# Altium project mini_project_one_rail.PrjPcb
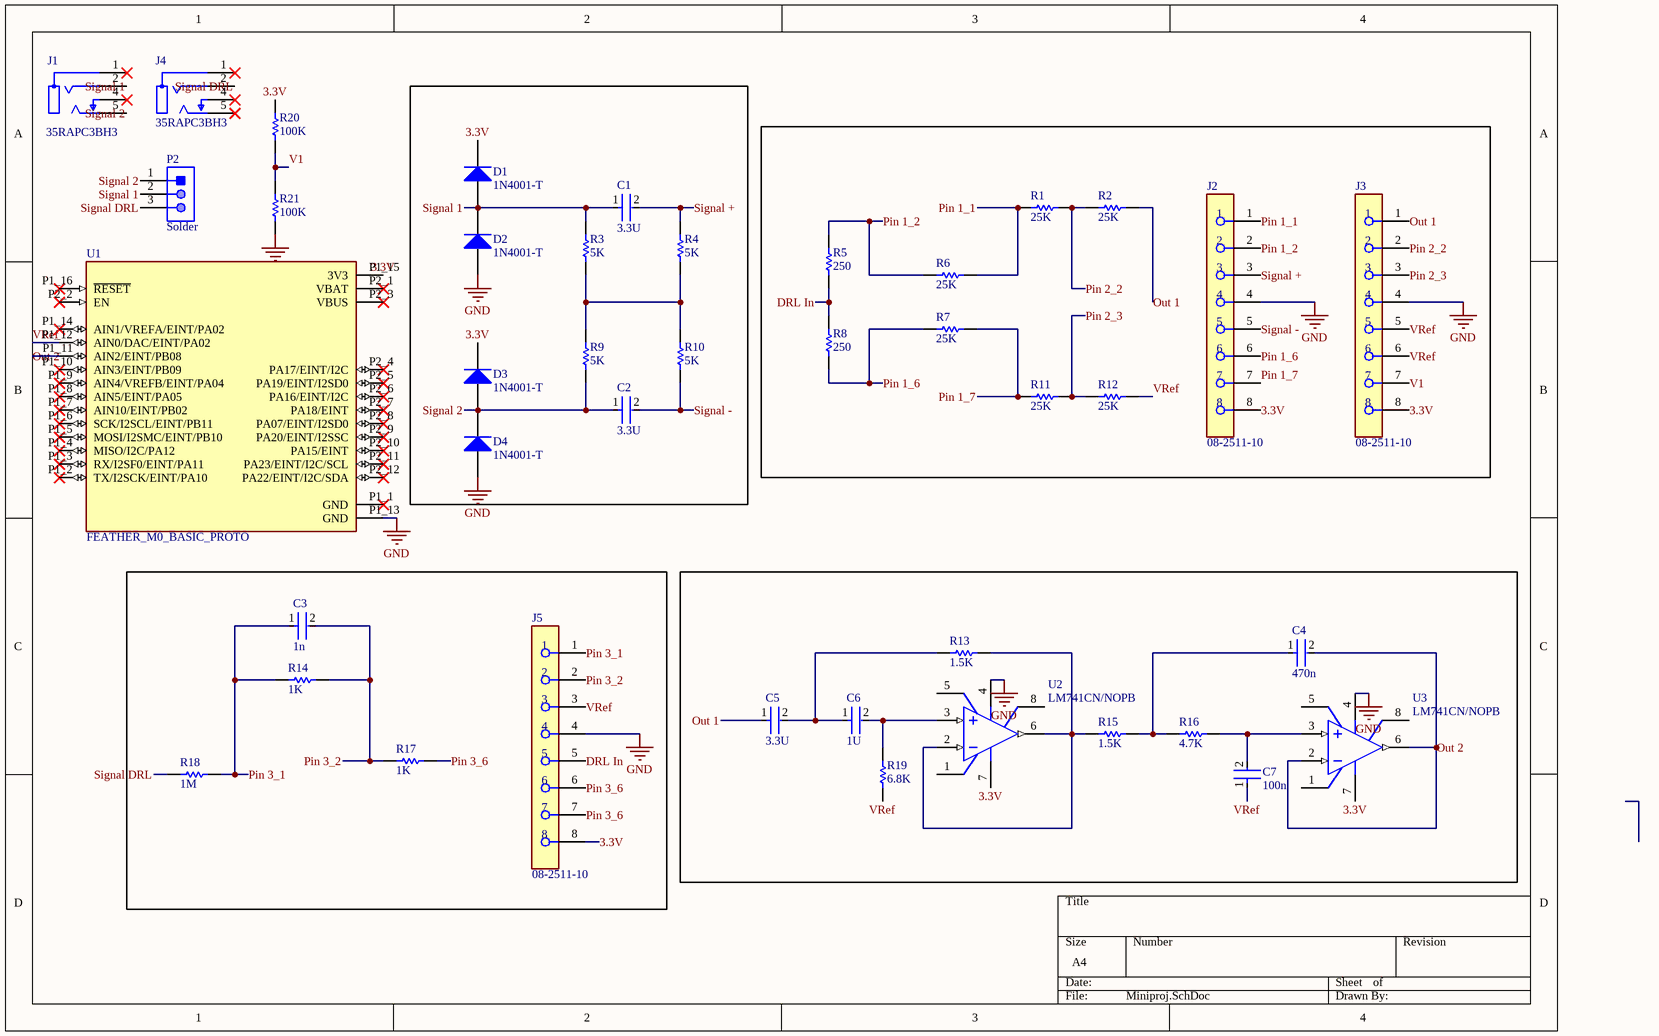
[diagram p0: Miniproj.SchDoc]
1 sheet, 41 parts. Net scope: global (net labels, ports and power ports of the same name join across sheets).
Board file: EMG.PcbDoc

## Sheet Miniproj.SchDoc
size A4; SheetNumber: 1; SheetTotal: 1

### Parts
C1  3.3U  [FP-RCE3DB-MFG]
C2  3.3U  [FP-RCE3DB-MFG]
C3  1n  [FP-RCE3DB-MFG]
C4  470n  [FP-RCE3DB-MFG]
C5  3.3U  [FP-RCE3DB-MFG]
C6  1U  [FP-RCE3DB-MFG]
C7  100n  [FP-RCE3DB-MFG]
D1  1N4001-T  [DIOD-DO-41-P-2_V]
D2  1N4001-T  [DIOD-DO-41-P-2_V]
D3  1N4001-T  [DIOD-DO-41-P-2_V]
D4  1N4001-T  [DIOD-DO-41-P-2_V]
J1  35RAPC3BH3  [FP-35RAPC3BH3-MFG]
J2  08-2511-10  [FP-08-2511-10-MFG]
J3  08-2511-10  [FP-08-2511-10-MFG]
J4  35RAPC3BH3  [FP-35RAPC3BH3-MFG]
J5  08-2511-10  [FP-08-2511-10-MFG]
P2  Solder  [JST-B3B-PH-K-S-3_V]
R1  25K  [RESA60-630X240]
R2  25K  [RESA60-630X240]
R3  5K  [RESA60-630X240]
R4  5K  [RESA60-630X240]
R5  250  [RESA60-630X240]
R6  25K  [RESA60-630X240]
R7  25K  [RESA60-630X240]
R8  250  [RESA60-630X240]
R9  5K  [RESA60-630X240]
R10  5K  [RESA60-630X240]
R11  25K  [RESA60-630X240]
R12  25K  [RESA60-630X240]
R13  1.5K  [RESA60-630X240]
R14  1K  [RESA60-630X240]
R15  1.5K  [RESA60-630X240]
R16  4.7K  [RESA60-630X240]
R17  1K  [RESA60-630X240]
R18  1M  [RESA60-630X240]
R19  6.8K  [RESA60-630X240]
R20  100K  [RESA60-630X240]
R21  100K  [RESA60-630X240]
U1  FEATHER_M0_BASIC_PROTO  [MODULE_FEATHER_M0_BASIC_PROTO]
U2  LM741CN/NOPB  [P0008A]
U3  LM741CN/NOPB  [P0008A]

### Nets
GND: D2.1(A) D4.1(A) J2.4 J3.4 J5.4 R21.1 U1.P1_13(GND) U2.4(V-) U3.4(V-)
3.3V: D1.2(K) D3.2(K) J2.8 J3.8 J5.8 R20.2 U1.P1_15(3V3) U2.7(V+) U3.7(V+)
DRL In: J5.5 R5.2 R8.1
Out 1: C5.1 J3.1 R2.1
Out 2: C4.2 U1.P1_11(AIN2/EINT/PB08) U3.2(IN-) U3.6(OUT)
Pin 1_1: J2.1 R1.2 R6.1
Pin 1_2: J2.2 R5.1 R6.2
Pin 1_6: J2.6 R7.2 R8.2
Pin 1_7: J2.7 R7.1 R11.2
Pin 2_2: J3.2 R1.1 R2.2
Pin 2_3: J3.3 R11.1 R12.2
Pin 3_1: C3.1 J5.1 R14.2 R18.1
Pin 3_2: C3.2 J5.2 R14.1 R17.2
Pin 3_6: J5.6 J5.7 R17.1
Signal 1: C1.1 D1.1(A) D2.2(K) J1.2 P2.2 R3.2
Signal 2: C2.1 D3.1(A) D4.2(K) J1.5 P2.1 R9.1
Signal +: C1.2 J2.3 R4.2
Signal -: C2.2 J2.5 R10.1
Signal DRL: J4.2 P2.3 R18.2
V1: J3.7 R20.1 R21.2
VRef: C7.1 J3.5 J3.6 J5.3 R12.1 R19.2 U1.P1_12(AIN0/DAC/EINT/PA02)
NetC4_1: C4.1 R15.1 R16.2
NetC5_2: C5.2 C6.1 R13.2
NetC6_2: C6.2 R19.1 U2.3(IN+)
NetC7_2: C7.2 R16.1 U3.3(IN+)
NetR3_1: R3.1 R4.1 R9.2 R10.2
NetR13_1: R13.1 R15.2 U2.2(IN-) U2.6(OUT)

Not connected (* = marked no-connect by the designer): J1 1* 4*; J4 1* 4* 5*; U1 P1_1(GND)* P1_2(TX/I2SCK/EINT/PA10)* P1_3(RX/I2SF0/EINT/PA11)* P1_4(MISO/I2C/PA12)* P1_5(MOSI/I2SMC/EINT/PB10)* P1_6(SCK/I2SCL/EINT/PB11)* P1_7(AIN10/EINT/PB02)* P1_8(AIN5/EINT/PA05)* P1_9(AIN4/VREFB/EINT/PA04)* P1_10(AIN3/EINT/PB09)* P1_14(AIN1/VREFA/EINT/PA02)* P1_16(~{RESET})* P2_1(VBAT)* P2_2(EN)* P2_3(VBUS)* P2_4(PA17/EINT/I2C)* P2_5(PA19/EINT/I2SD0)* P2_6(PA16/EINT/I2C)* P2_7(PA18/EINT)* P2_8(PA07/EINT/I2SD0)* P2_9(PA20/EINT/I2SSC)* P2_10(PA15/EINT)* P2_11(PA23/EINT/I2C/SCL)* P2_12(PA22/EINT/I2C/SDA)*; U2 1(OFS_NULL) 5(OFS_NULL) 8(NC); U3 1(OFS_NULL) 5(OFS_NULL) 8(NC)

### Library data of the parts
C1-C7 = CMP-06035-005830-1: Cap Ceramic 10uF 25V X7R ±10% Radial 2.5mm +125°C Automotive Ammo Pack; Lead/Base Style: Straight; Lead Diameter: 0.5mm; Case/Package: Radial; Voltage Rating (DC): 25V; Tolerance: 10%; Lead Pitch: 0.098inch; Termination: Radial; Height - Seated (Max): 0.197inch; Resistor Type: Ceramic; Min Operating Temperature: -55°C; Dielectric: X7R; Length: 0.217inch; Voltage Rating: 25V; Width: 0.157inch; Height: 5mm; Packaging: Tape and Reel; Ratings: AEC-Q200; Max Operating Temperature: 125°C; Package Quantity: 1500; Mount: Through Hole; Capacitance: 10uF
D1-D4 = CMP-0639-00006-2: 1.0 A Rectifier, 15 pF, 50 V, -65 to 150 degC, 2-Pin DO-41 Plastic, RoHS, Tape and Reel; Manufacturer: Diodes Inc; VF (V): 1; CT (pF): 15; Max. IR (uA): 5; VRRM (V): 50; Max. IFSM (A): 30; RoHS: TRUE; Mounting Technology: Through Hole; PartNumber: 1N4001-T; ComponentLink2Description: Datasheet; DatasheetVersion: Rev. 8-2; Operating Temperature Range (degC): -65 to 150; Packing: Tape and Reel; PackageReference: DO-41-P-2; ComponentLink1URL: http://diodes.com/; PackageDescription: 2-Pin Axial Lead, Body 4.635 x 2.36 mm, Lead Spread 25.4 mm; ComponentLink2URL: http://diodes.com/datasheets/ds28002.pdf; Max. Average Rectified Current IO (A): 1; ComponentLink1Description: Manufacturer URL
J1 J4 = CMP-47983-000003-1: CONN JACK STEREO 3.5MM R/A; Gender: Female; Number of Positions: 3; Body Color: Black; Number of Ports: 1; Voltage Rating: 500V; Shielding: Unshielded; Body Material: Brass; Orientation: Right Angle; RoHS Compliant: Yes; Termination: Solder; Lead Free: Lead Free; Package Quantity: 1; Series: 35; Housing Material: PBT; Color: Black; Packaging: Bulk; Contact Plating: Silver; Mount: Through Hole; Contact Material: Copper Alloy; Number of Terminals/Pins: 3
J2 J3 J5 = CMP-40957-000003-1: CONN IC DIP SOCKET 8POS TIN; Manufacturer: Aries Electronics; Pitch: 2.54mm; Conn Gender: Female; Is Female: yes; Number Of Contacts: 8; Current Rating: 1A; Standoff Height: 0.51mm; Conn Orientation: Vertical; Socket Package: DIP8; Device Class L2: IC and Component Sockets; Lead Free: Yes; Package: 0; Automotive: No; ComponentLink2URL: https://www.arieselec.com/products/data/12004-dip-test-socket.pdf; Contact Material: Tin; Height: 7.75mm; Digikey Description: CONN IC DIP SOCKET 8POS TIN; Temperature Range High: +105°C; RoHS: TRUE; ComponentLink2Description: Datasheet; Temperature: -55°C to +105°C; Temperature Range Low: -55°C; Device Class L1: Connectors; Device Class L3: unset; Manufacturer Part Number: 08-2511-10; Octopart: https://octopart.com/08-2511-10-aries-767661; Number Of Rows: 2; Category: Conn
P2 = CMP-2000-05164-1: Male Header, Pitch 2 mm, 1 x 3 Position, Height 6 mm, Tail Length 3.4 mm, -25 to 85 degC, RoHS, Bulk; Manufacturer: JST; Style/Orientation: StraightHeader/Plug; Pitch: 2mm; No of Positions: 3; Termination: Crimp; Manufacturer URL: http://www.jst.com/home2.html; Datasheet Version: Oct-06; Type: ShroudedHeader; Datasheet URL: https://datasheet.ciiva.com/11746/0900766b80826550-11746939.pdf
R1-R21 = CMP-1659-00075-1: Axial Resistor, 1 KOhm, +/- 1%, 250 mW, -55 to 155 degC, 2-Pin THD, RoHS, Bulk; Voltage Rating: 250 V; Resistance: 10 kohm; Power Rating: 250 mW; ComponentLink2Description: Datasheet; RoHSCompliant: true; PackageReference: MFR-25; Case\Package: Axial; Max Operating Temperature: 155 degC; DatasheetVersion: Apr-13; Tolerance: 1%; ComponentLink1URL: http://www.yageo.com/; Length: 0.248 inch; ComponentLink2URL: http://www.yageo.com/documents/recent/Yageo%20LR_MFR_2013.pdf; Packaging: Bulk; Package Quantity: 200; PackageDescription: 2-Pin Axial Lead, Dia 2.4 mm, Body Length 6.3 mm; Min Operating Temperature: -55 degC; ComponentLink1Description: Manufacturer URL
U1 = CMP-003-000000-1: ATSAMD21G18 Feather M0 Basic Proto series ARM® Cortex®-M0+ MCU 32-Bit Embedded Evaluation Board; MF: Adafruit Industries; Price: None; Source: FEATHER_M0_BASIC_PROTO.SchLib; Check_prices: https://www.snapeda.com/parts/Feather%20M0%20Basic%20Proto/Adafruit+Industries/view-part/?ref=eda; SnapEDA_Link: https://www.snapeda.com/parts/Feather%20M0%20Basic%20Proto/Adafruit+Industries/view-part/?ref=snap; Component Type: Standard; Pin Count: 28; Value: *; Package: None; Availability: Not in stock; MP: Feather M0 Basic Proto; Design Item ID: FEATHER_M0_BASIC_PROTO
U2 U3 = CMP-0055-00162-3: Operational Amplifier, 8-pin MDIP, Pb-Free; Manufacturer: Texas Instruments; PackageTopMarking: NSUZXYTTE#*LM*741CN; PowerWise: N; CompType: Amplifiers; ComponentLink1Description: Datasheet URL; ComponentLink1URL: http://www.ti.com/general/docs/lit/getliterature.tsp?genericPartNumber=LM741&fileType=pdf; PackageDescription: MDIP, .365 x .250 x .130in, 8 Lead, .100in Pitch; RoHS: Y; PinCount: 8; Code_JEDEC: MS-001-BA; Package Reference: P0008A